# EAGLE design ottoesp-2s-wrover (EAGLE 9.6.2)
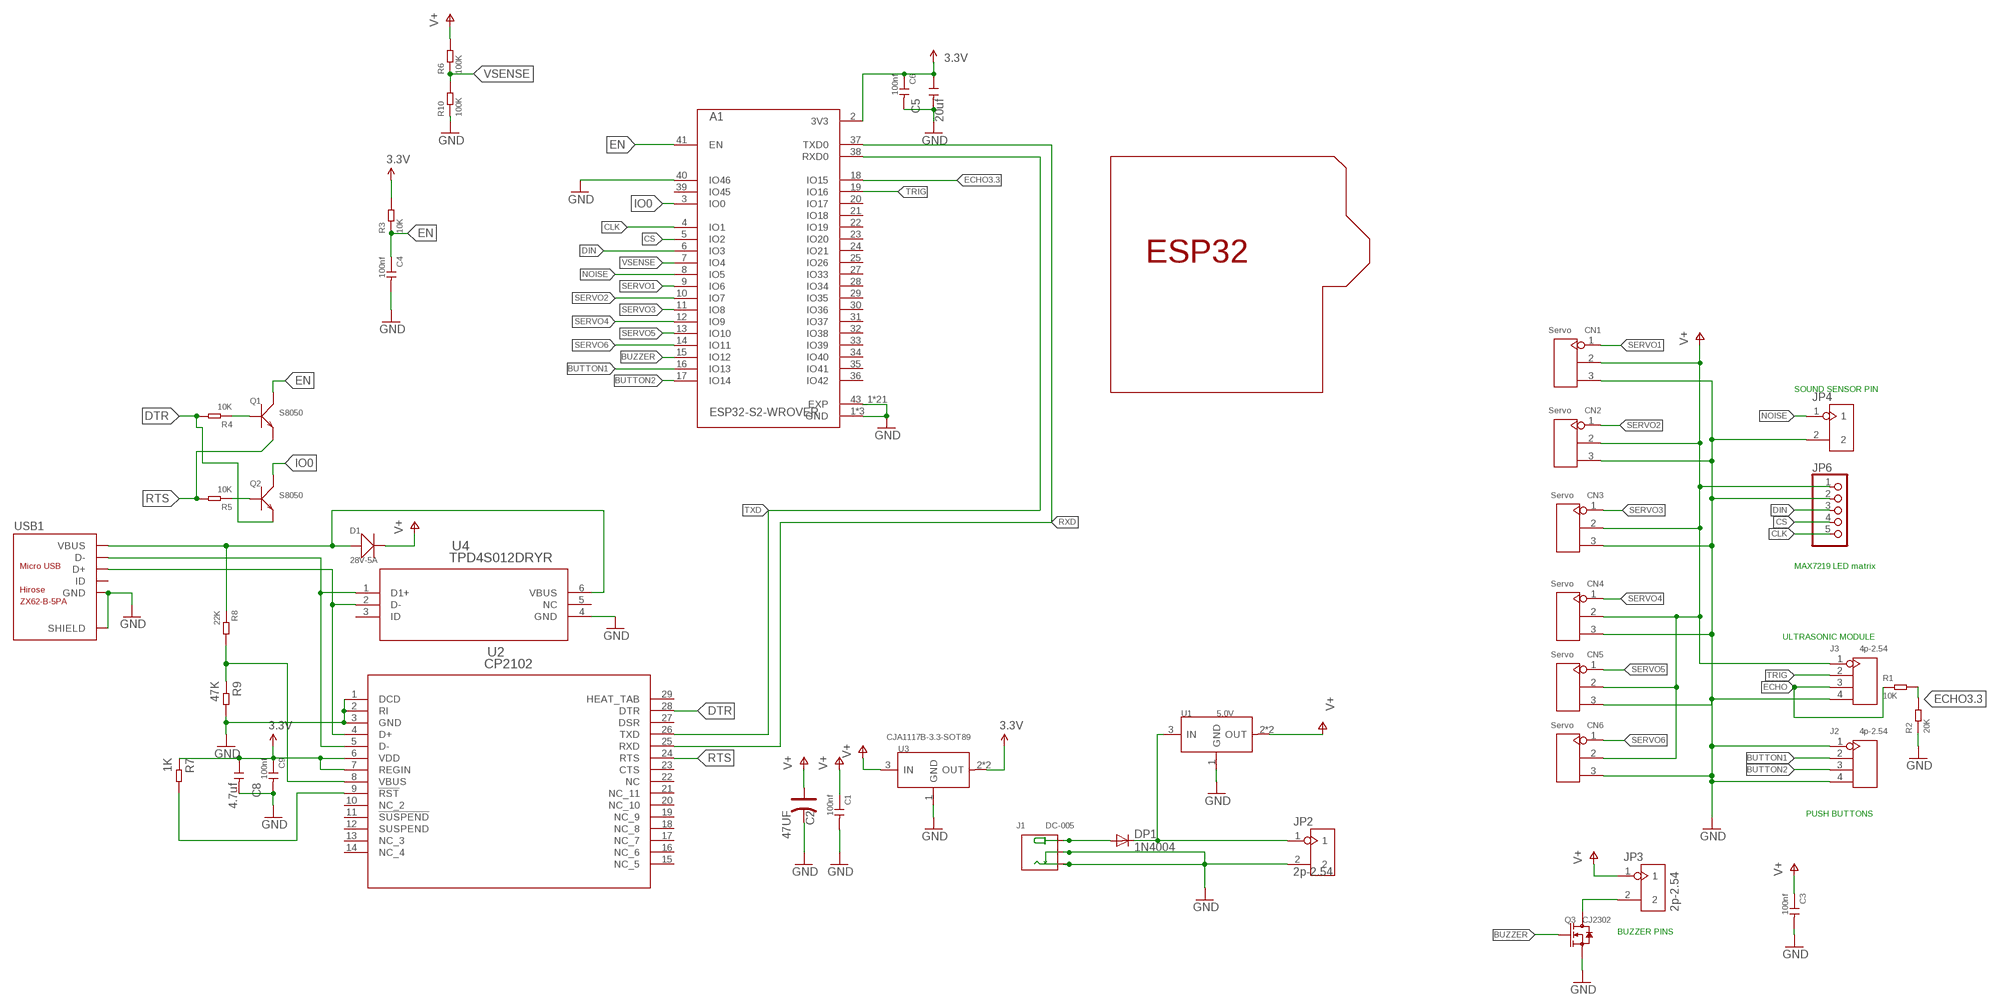
[diagram p0: schematic, sheet 1]

## Parts
A1  ESP32-S2-WROVER  [MODULE_ESP32-S2-WROVER]
C1  100nf  CERAMIC-100NF-50V-10%-X7R(0805)  [C0805]
C2  47UF  ALUMINUM-SMD-47UF-25V(D6.3-H5.3MM)  [ELECTRO-SMD-C-6MM]
C3  100nf  CERAMIC-100NF-50V-10%-X7R(0805)  [C0805]
C4  100nf  CERAMIC-100NF-50V-10%-X7R(0805)  [C0805]
C5  20uf  CERAMIC-22UF-16V-10%-X7R(1206)  [C1206]
C6  100nf  CERAMIC-100NF-50V-10%-X7R(0805)  [C0805]
C8  4.7uf  CERAMIC-4.7UF-25V-10%-X5R(0805)  [C0805]
C9  100nf  CERAMIC-100NF-50V-10%-X7R(0805)  [C0805]
CN1  Servo  DIP-BLACK-MALE-HEADER-VERT(3P-2.54)  [H3-2.54]
CN2  Servo  DIP-BLACK-MALE-HEADER-VERT(3P-2.54)  [H3-2.54]
CN3  Servo  DIP-BLACK-MALE-HEADER-VERT(3P-2.54)  [H3-2.54]
CN4  Servo  DIP-BLACK-MALE-HEADER-VERT(3P-2.54)  [H3-2.54]
CN5  Servo  DIP-BLACK-MALE-HEADER-VERT(3P-2.54)  [H3-2.54]
CN6  Servo  DIP-BLACK-MALE-HEADER-VERT(3P-2.54)  [H3-2.54]
D1  28V-5A  SMD-DIODE-SCHOTTKY-28V-5A(DO-214AA)  [DO-214AA]
DP1  1N4004  [DO41-10]
J1  DC-005  CONN-POWER-JACK-2.1MM(DC-005)  [DCJ3P-14.2X11.0X9.0MM]
J2  4p-2.54  DIP-BLACK-MALE-HEADER-VERT(4P-2.54)  [H4-2.54]
J3  4p-2.54  DIP-BLACK-MALE-HEADER-VERT(4P-2.54)  [H4-2.54]
JP2  2p-2.54  DIP-BLACK-MALE-HEADER-VERT(2P-2.54)  [H2-2.54]
JP3  2p-2.54  DIP-BLACK-MALE-HEADER-VERT(2P-2.54)  [H2-2.54]
JP4  2p-2.54  DIP-BLACK-MALE-HEADER-VERT(2P-2.54)  [H2-2.54]
JP6  PINHD-1X5  [1X05]
Q1  S8050  SMD-TRANSISTORS-NPN-25V-500MW-S8050(SOT-23)  [SOT-23]
Q2  S8050  SMD-TRANSISTORS-NPN-25V-500MW-S8050(SOT-23)  [SOT-23]
Q3  CJ2302  SMD-MOSFET-N-CH-20V-2.1A-CJ2302(SOT-23)  [SOT-23]
R1  10K  SMD-RES-10K-1%-1/8W(0805)  [R0805]
R2  20K  SMD-RES-20K-5%-1/8W(0805)  [R0805]
R3  10K  SMD-RES-10K-1%-1/8W(0805)  [R0805]
R4  10K  SMD-RES-10K-1%-1/8W(0805)  [R0805]
R5  10K  SMD-RES-10K-1%-1/8W(0805)  [R0805]
R6  100K  SMD-RES-100K-1%-1/8W(0805)  [R0805]
R7  1K  SMD-RES-2K-1%-1/8W(0805)  [R0805]
R8  22K  SMD-RES-22K-1%-1/8W(0805)  [R0805]
R9  47K  SMD-RES-47K-5%-1/10W(0603)  [R0603]
R10  100K  SMD-RES-100K-1%-1/8W(0805)  [R0805]
U1  5.0V  PMIC-CJT1117-5.0(SOT223)  [SOT-223]
U2  CP2102  [QFN28N5X5-0P5P]
U3  CJA1117B-3.3-SOT89  PMIC-CJA1117B-3.3(SOT-89)  [SOT-89]
U4  TPD4S012DRYR  [DRY6]
U$2  ESP32_SHIELDSMALL  [ESP32_ARDUINOSHIELDSMALL]
USB1  ZX62-B-5PA  MICRO-USB-SMD(ZX62-B-5PA)  [MICRO-USB5+6P-SMD-0.65-AB]

## Nets
3.3V: A1.2(3V3) C5.1 C6.1 C8.1 C9.1 R3.2 R7.1 U2.6(VDD) U2.7(REGIN) U3.2(OUT) U3.4(OUT)
BUTTON1: A1.16(IO13) J2.2
BUTTON2: A1.17(IO14) J2.3
BUZZER: A1.15(IO12) Q3.1(G)
CLK: A1.4(IO1) JP6.5
CS: A1.5(IO2) JP6.4
DIN: A1.6(IO3) JP6.3
DTR: Q2.2(E) R4.2 U2.28(DTR)
ECHO: J3.3 R1.1
ECHO3.3: A1.18(IO15) R1.2 R2.2
EN: A1.41(EN) C4.1 Q1.3(C) R3.1
GND: A1.1(GND) A1.26(GND) A1.40(IO46) A1.42(GND) A1.43_1(EXP) A1.43_2(EXP) A1.43_3(EXP) A1.43_4(EXP) A1.43_5(EXP) A1.43_6(EXP) A1.43_7(EXP) A1.43_8(EXP) A1.43_9(EXP) A1.43_10(EXP) A1.43_11(EXP) A1.43_12(EXP) A1.43_13(EXP) A1.43_14(EXP) A1.43_15(EXP) A1.43_16(EXP) A1.43_17(EXP) A1.43_18(EXP) A1.43_19(EXP) A1.43_20(EXP) A1.43_21(EXP) C1.2 C2.- C3.2 C4.2 C5.2 C6.2 C8.2 C9.2 CN1.3 CN2.3 CN3.3 CN4.3 CN5.3 CN6.3 J1.-1(-) J1.-2(CDN) J2.1 J2.4 J3.4 JP2.2 JP4.2 JP6.2 Q3.2(S) R2.1 R9.2 R10.1 U1.1(GND) U2.1(DCD) U2.2(RI) U2.3(GND) U3.1(GND) U4.4(GND) USB1.5(GND) USB1.P1(SHIELD) USB1.P2(SHIELD) USB1.P3(SHIELD) USB1.P4(SHIELD) USB1.P5(SHIELD) USB1.P6(SHIELD)
IO0: A1.3(IO0) Q2.3(C)
N$3: JP3.2 Q3.3(D)
N$4: Q1.1(B) R4.1
N$5: Q2.1(B) R5.1
N$6: R7.2 U2.9(!RST)
N$7: R8.2 R9.1 U2.8(VBUS)
N$8: U2.5(D-) U4.1(D1+) USB1.2(D-)
N$9: DP1.A J1.+
N$10: U2.4(D+) U4.2(D-) USB1.3(D+)
N$11: DP1.C JP2.1 U1.3(IN)
NOISE: A1.8(IO5) JP4.1
RTS: Q1.2(E) R5.2 U2.24(RTS)
RXD: A1.37(TXD0) U2.25(RXD)
SERVO1: A1.9(IO6) CN1.1
SERVO2: A1.10(IO7) CN2.1
SERVO3: A1.11(IO8) CN3.1
SERVO4: A1.12(IO9) CN4.1
SERVO5: A1.13(IO10) CN5.1
SERVO6: A1.14(IO11) CN6.1
TRIG: A1.19(IO16) J3.2
TXD: A1.38(RXD0) U2.26(TXD)
V+: C1.1 C2.+ C3.1 CN1.2 CN2.2 CN3.2 CN4.2 CN5.2 CN6.2 D1.- J3.1 JP3.1 JP6.1 R6.2 U1.2(OUT) U1.TER(OUT) U3.3(IN)
VBUS: D1.+ R8.1 U4.6(VBUS) USB1.1(VBUS)
VSENSE: A1.7(IO4) R6.1 R10.2
Unconnected: A1.20(IO17) A1.21(IO18) A1.22(IO19) A1.23(IO20) A1.24(IO21) A1.25(IO26) A1.27(IO33) A1.28(IO34) A1.29(IO35) A1.30(IO36) A1.31(IO37) A1.32(IO38) A1.33(IO39) A1.34(IO40) A1.35(IO41) A1.36(IO42) A1.39(IO45) U2.10(NC_2) U2.11(!SUSPEND) U2.12(SUSPEND) U2.13(NC_3) U2.14(NC_4) U2.15(NC_5) U2.16(NC_6) U2.17(NC_7) U2.18(NC_8) U2.19(NC_9) U2.20(NC_10) U2.21(NC_11) U2.22(NC) U2.23(CTS) U2.27(DSR) U2.29(HEAT_TAB) U4.3(ID) U4.5(NC) USB1.4(ID)

## Notes on the sheet
- SOUND SENSOR PIN
- MAX7219 LED matrix
- ULTRASONIC MODULE
- PUSH BUTTONS
- BUZZER PINS

## Library data of the parts
A1 = ESP32-S2-WROVER:ESP32-S2-WROVER: WiFi 802.11b/g/n Transceiver Module 2.4GHz Antenna Not Included Surface Mount Check prices <https://snapeda.com/parts/ESP32-S2-WROVER/Espressif%20Systems/view-part/?ref=eda>; AVAILABILITY: Warning; DESCRIPTION: WiFi 802.11b/g/n Transceiver Module 2.4GHz Antenna Not Included Surface Mount; DIGIKEY-PURCHASE-URL: https://snapeda.com/shop?store=DigiKey&id=4614060; MF: Espressif Systems; MP: ESP32-S2-WROVER; PACKAGE: VFQFN-56 Espressif Systems; PRICE: None
C1 C4 C6 C9 = OPL_Capacitor:CERAMIC-100NF-50V-10%-X7R(0805): 302010165; MPN: CC0805KRX7R9BB104
C2 = OPL_Capacitor:ALUMINUM-SMD-47UF-25V(D6.3-H5.3MM): 302030059; MPN: CS1E470M-CRE54
C3 = Seeed-Capacitor:CERAMIC-100NF-50V-10%-X7R(0805): 302010165; MPN: CC0805KRX7R9BB104
C5 = OPL_Capacitor:CERAMIC-22UF-16V-10%-X7R(1206): 302010182
C8 = OPL_Capacitor:CERAMIC-4.7UF-25V-10%-X5R(0805): 302010146; MPN: CC0805KKX5R8BB475
CN1-CN6 = OPL_Connector:DIP-BLACK-MALE-HEADER-VERT(3P-2.54): 320020079; VALUE: 3p-2.54
D1 = Seeed-Diode:SMD-DIODE-SCHOTTKY-28V-5A(DO-214AA): 304020021; MPN: SS54B
DP1 = adafruit:1N4004: DIODE General purpose 1N400x type rectifier (With bigger pads) http://www.ladyada.net/library/pcb/eaglelibrary.html
J1 = OPL_Connector:CONN-POWER-JACK-2.1MM(DC-005): 320120003; MPN: DC-005
J2 J3 = OPL_Connector:DIP-BLACK-MALE-HEADER-VERT(4P-2.54): 320020017; MPN: P125-1104A0BS116A1
JP2-JP4 = OPL_Connector:DIP-BLACK-MALE-HEADER-VERT(2P-2.54): 320020016; MPN: P125-1102A0BS116A1
JP6 = pinhead:PINHD-1X5: PIN HEADER
Q1 Q2 = OPL_Discrete_Semiconductor:SMD-TRANSISTORS-NPN-25V-500MW-S8050(SOT-23): 305010017; MPN: S8050
Q3 = Seeed-Transistor:SMD-MOSFET-N-CH-20V-2.1A-CJ2302(SOT-23): 305030015; MPN: CJ2302
R1 R3-R5 = OPL_Resistor:SMD-RES-10K-1%-1/8W(0805): 301012152; MPN: RC0805FR-0710KL
R2 = OPL_Resistor:SMD-RES-20K-5%-1/8W(0805): 301012190; MPN: RC0805JR-071KL; VALUE: 1K
R6 R10 = OPL_Resistor:SMD-RES-100K-1%-1/8W(0805): 301012150; MPN: RC0805JR-071KL; VALUE: 1K
R7 = OPL_Resistor:SMD-RES-2K-1%-1/8W(0805): 301012164; MPN: RC0805JR-071KL
R8 = OPL_Resistor:SMD-RES-22K-1%-1/8W(0805): 301012161; MPN: RC0805JR-071KL; VALUE: 1K
R9 = OPL_Resistor:SMD-RES-47K-5%-1/10W(0603): 301010084; MPN: RC0603JR-0747KL
U1 = Seeed-IC:PMIC-CJT1117-5.0(SOT223): 310030096; MPN: CJT1117-5.0; VALUE: CJT1117-5.0-SOT223
U2 = cp2102:CP2102; MANUFACTURER_PART_NUMBER: CP2102; VENDOR: Silicon Labs
U3 = OPL_IC:PMIC-CJA1117B-3.3(SOT-89): 310030095; MPN: CJA1117B-3.3
U4 = TPD4S012:TPD4S012DRYR; MANUFACTURER_PART_NUMBER: TPD4S012DRYR; VENDOR: Texas Instruments
U$2 = ottoesp:ESP32_SHIELDSMALL
USB1 = OPL_Connector:MICRO-USB-SMD(ZX62-B-5PA): 320010005; MPN: ZX62-B-5PA

## Board
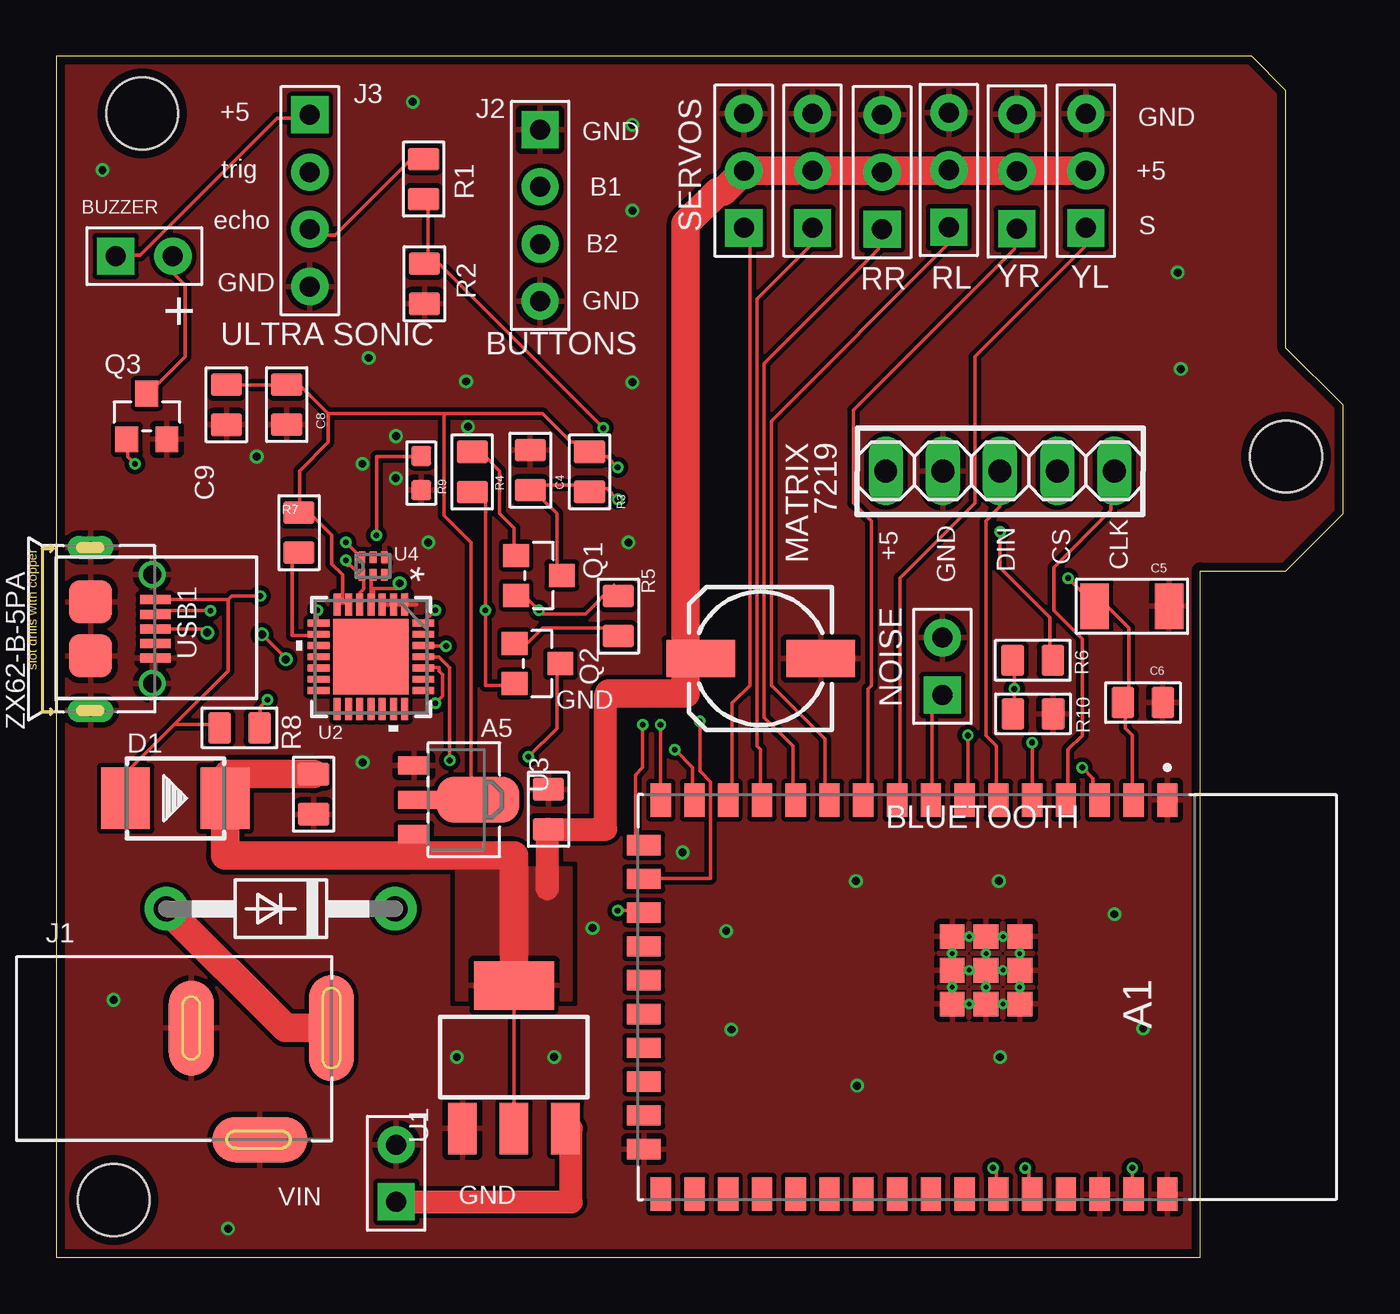
[diagram p1: board, top side]
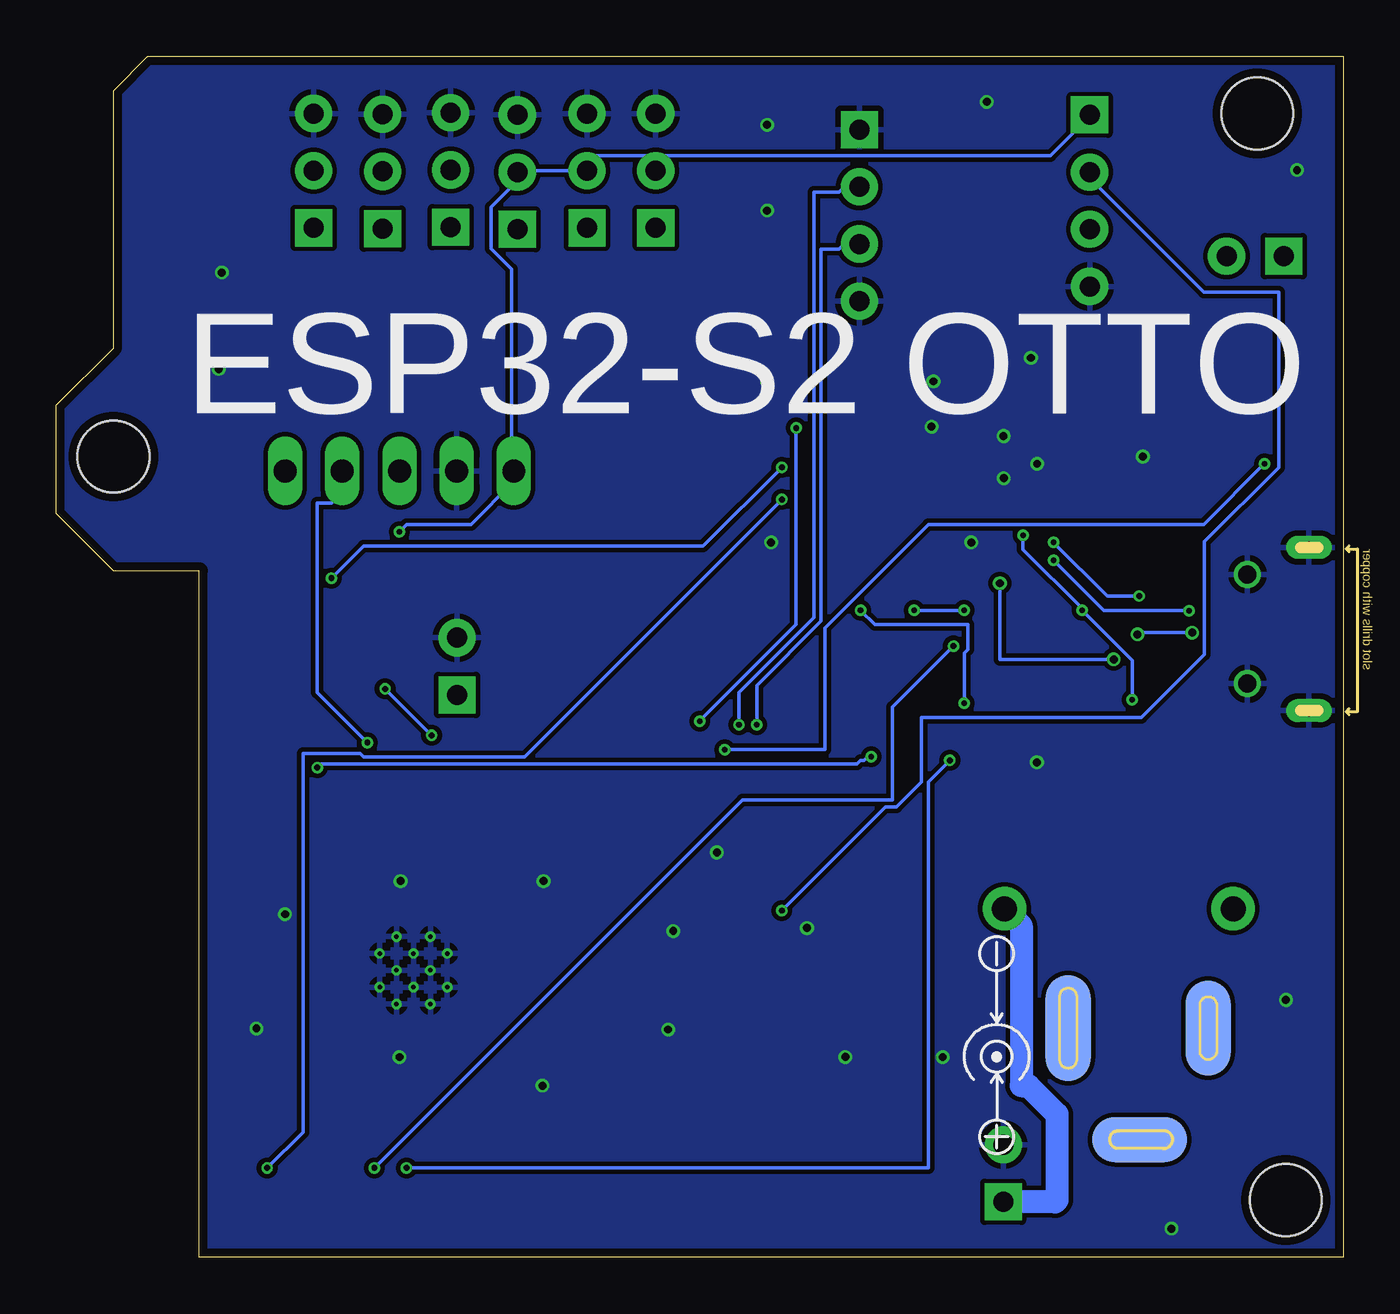
[diagram p2: board, bottom side, seen from below]

Size 57.15 x 53.34 mm. Coordinates in mm from the lower left corner, seen from the top.
Copper layers (1*16): Top 0.035559375mm / dielectric 1.6mm / Bottom 0.035559375mm
Design rules "oshpark-2layer": minimum track width 6mil, minimum drill 10mil, track to track 6mil, track to pad 6mil, pad to pad 6mil, via to via 6mil, smd to smd 6mil, copper to edge 15mil, drill to drill 6mil, minimum pad ring 5mil, minimum via ring 5mil, stop-mask expansion 2.5mil, vias tented up to drill 0mil, thermal gap 10mil

### Footprints (pad centres in the part's own frame; a part is rotated, then mirrored left to right if it is on the bottom)
MODULE_ESP32-S2-WROVER = smd 1.5 x 0.9: 1 -8.75,8; 2 -8.75,6.5; 3 -8.75,5; 4 -8.75,3.5; 5 -8.75,2; 6 -8.75,0.5; 7 -8.75,-1; 8 -8.75,-2.5; 9 -8.75,-4; 10 -8.75,-5.5; 11 -8.75,-7; 12 -8.75,-8.5; 13 -8.75,-10; 14 -8.75,-11.5; 15 -8.75,-13; 16 -8.75,-14.5; 27 8.75,-14.5; 28 8.75,-13; 29 8.75,-11.5; 30 8.75,-10; 31 8.75,-8.5; 32 8.75,-7; 33 8.75,-5.5; 34 8.75,-4; 35 8.75,-2.5; 36 8.75,-1; 37 8.75,0.5; 38 8.75,2; 39 8.75,3.5; 40 8.75,5; 41 8.75,6.5; 42 8.75,8 | smd 0.9 x 1.5: 17 -6.75,-15.25; 18 -5.25,-15.25; 19 -3.75,-15.25; 20 -2.25,-15.25; 21 -0.75,-15.25; 22 0.75,-15.25; 23 2.25,-15.25; 24 3.75,-15.25; 25 5.25,-15.25; 26 6.75,-15.25 | smd 1.1 x 1.1: 43_1 -2.69,1.45; 43_2 -1.19,1.45; 43_3 0.31,1.45; 43_4 -2.69,-0.05; 43_5 -1.19,-0.05; 43_6 0.31,-0.05; 43_7 -2.69,-1.55; 43_8 -1.19,-1.55; 43_9 0.31,-1.55 | drill 0.2 pad 0.3: 43_10 -1.94,1.45; 43_11 -0.44,1.45; 43_12 -2.69,0.7; 43_13 -1.19,0.7; 43_14 0.31,0.7; 43_15 -1.94,-0.05; 43_16 -0.44,-0.05; 43_17 -2.69,-0.8; 43_18 -1.19,-0.8; 43_19 0.31,-0.8; 43_20 -1.94,-1.55; 43_21 -0.44,-1.55
C0805 = smd 1.397 x 1.016: 1 0,0.889; 2 0,-0.889
ELECTRO-SMD-C-6MM = smd 3.048 x 1.651: + 2.667,0; - -2.667,0
C1206 = smd 1.27 x 2.032: 1 -1.651,0; 2 1.651,0
H3-2.54 = drill 0.889 pad 1.651 square: 1 0,2.54 | drill 0.889 pad 1.651: 2 0,0; 3 0,-2.54
DO-214AA = smd 2.159 x 2.743: + -2.21,0; - 2.21,0
DO41-10 = drill 1.118 pad 1.93: A 5.08,0; C -5.08,0
DCJ3P-14.2X11.0X9.0MM = smd 2 x 4.7: + 3.175,0 | smd 2 x 4.7 bottom: +1 3.175,0 | smd 2 x 4.2: -1 -3.048,0 | smd 4.2 x 2: -2 0,-4.953 | smd 2 x 4.2 bottom: -3 -3.048,0 | smd 4.2 x 2 bottom: -4 0,-4.953
H4-2.54 = drill 0.889 pad 1.651 square: 1 0,3.81 | drill 0.889 pad 1.651: 2 0,1.27; 3 0,-1.27; 4 0,-3.81
H2-2.54 = drill 0.889 pad 1.651 square: 1 0,1.27 | drill 0.889 pad 1.651: 2 0,-1.27
1X05 = drill 1.016 long: 1 -5.08,0; 2 -2.54,0; 3 0,0; 4 2.54,0; 5 5.08,0
SOT-23 = smd 1.016 x 1.143: 1 -0.889,-1.016; 2 0.889,-1.016; 3 0,1.016
R0805 = smd 1.397 x 1.016: 1 0,0.889; 2 0,-0.889
R0603 = smd 0.889 x 0.889: 1 0,0.762; 2 0,-0.762
SOT-223 = smd 1.27 x 2.286: 1 -2.286,-3.175; 2 0,-3.175; 3 2.286,-3.175 | smd 3.556 x 2.159: TER 0,3.175
QFN28N5X5-0P5P = smd 0.965 x 0.305: 1 -2.324,1.5; 2 -2.324,1; 3 -2.324,0.5; 4 -2.324,0; 5 -2.324,-0.5; 6 -2.324,-1; 7 -2.324,-1.5; 15 2.324,-1.5; 16 2.324,-1; 17 2.324,-0.5; 18 2.324,0; 19 2.324,0.5; 20 2.324,1; 21 2.324,1.5 | smd 0.305 x 0.965: 8 -1.5,-2.324; 9 -1,-2.324; 10 -0.5,-2.324; 11 0,-2.324; 12 0.5,-2.324; 13 1,-2.324; 14 1.5,-2.324; 22 1.5,2.324; 23 1,2.324; 24 0.5,2.324; 25 0,2.324; 26 -0.5,2.324; 27 -1,2.324; 28 -1.5,2.324 | smd 3.353 x 3.353: 29 0,0
SOT-89 = smd 0.8 x 1.4: 1 -1.524,-1.905; 3 1.524,-1.905 | smd 0.8 x 1.9: 2 0,-1.651 | smd 2.032 x 3.65: 4 0,0.94
DRY6 = smd 0.52 x 0.3: 1 -0.385,0.5; 2 -0.385,0; 3 -0.385,-0.5; 4 0.385,-0.5; 5 0.385,0; 6 0.385,0.5
ESP32_ARDUINOSHIELDSMALL = hole 3.2: -13.97,33.02; 36.83,17.78; -15.24,-15.24
MICRO-USB5+6P-SMD-0.65-AB = smd 0.4 x 1.35: 1 -1.3,2.875; 2 -0.65,2.875; 3 0,2.875; 4 0.65,2.875; 5 1.3,2.875 | smd 1.9 x 1.9: P1 -1.2,0; P2 1.2,0 | drill 0.508 pad 1.016 long: P3 -3.625,0; P4 3.625,0 | drill 0.8: P5 -2.425,2.73; P6 2.425,2.73

### Placement (x,y rotation side)
A1  41.34,11.55 270 top
C1  21.85,19.9 180 top
C2  31.28,26.6 180 top
C3  11.42,20.57 0 top
C4  21.04,34.96 180 top
C5  47.76,28.91 0 top
C6  48.26,24.64 90 top
C8  10.23,37.87 0 top
C9  7.55,37.86 0 top
CN1  45.72,48.26 180 top
CN2  42.66,48.23 180 top
CN3  39.63,48.29 180 top
CN4  36.67,48.19 180 top
CN5  33.58,48.26 180 top
CN6  30.53,48.26 180 top
D1  5.28,20.38 0 top
DP1  9.96,15.48 180 top
J1  9.03,10.18 0 top
J2  21.49,46.27 0 top
J3  11.25,46.93 0 top
JP2  15.09,3.73 180 top
JP3  3.9,44.46 90 top
JP4  39.35,26.25 180 top
JP6  41.91,34.92 0 top
Q1  21.43,30.28 270 top
Q2  21.37,26.36 270 top
Q3  4.02,37.35 0 top
R1  16.31,47.89 0 top
R2  16.34,43.23 180 top
R3  23.68,34.88 180 top
R4  18.47,34.88 0 top
R5  24.96,28.47 180 top
R6  43.36,26.51 90 top
R7  10.77,32.18 0 top
R8  8.13,23.51 90 top
R9  16.2,34.83 0 top
R10  43.37,24.13 270 top
U1  20.32,8.89 0 top
U2  13.97,26.67 270 top
U3  17.78,20.32 270 top
U4  14.06,30.7 90 top
U$2  17.78,17.78 0 top
USB1  1.52,27.91 270 top

### Tracks (layer width: path | path; a pad name or v marks a point on that pad's centre or on a via)
3.3V  (via drill 0.25)
  Top 0.152: 18.41,20.32 U3.2 | 10.79,33.5 10.79,34.92 12.07,36.2 12.07,37.47 | 10.79,33.5 10.79,33.02 R7.1 10.79,33.5 | 12.07,37.47 10.79,38.73 C8.1 10.16,38.73 7.62,38.73 C9.1 | 12.07,37.47 17.23,37.47 | 17.23,37.47 21.59,37.47 22.86,36.2 23.5,36.2 R3.2 24.13,35.56 24.45,35.56 v24.92,35.08 | 18.41,20.32 18.41,31.75 17.23,32.94 17.23,37.47 | 18.41,20.32 U3.4 | A1.2 47.78,20.32 47.78,23.18 47.47,23.5 47.47,24.61 C6.1 47.62,24.77 47.62,27.94 46.36,29.21 C5.1 46.04,29.05 v44.93,30.16 | 12.7,29.05 12.86,29.05 U2.6 | 12.7,29.05 12.54,29.05 U2.7 | 12.7,29.05 12.7,30.32 12.22,30.8 12.22,32.07 10.79,33.5
  Bottom 0.152: v44.93,30.16 43.5,31.59 28.42,31.59 v24.92,35.08
BUTTON1  (via drill 0.25)
  Top 0.152: v26.83,23.65 26.83,20.32 A1.16
  Bottom 0.152: v26.83,23.65 26.83,25.08 23.5,28.42 23.5,47.31 22.38,47.31 22.22,47.47 21.59,47.47 J2.2
BUTTON2  (via drill 0.25)
  Top 0.152: v26.04,23.65 26.04,21.75 25.72,21.43 25.72,18.73 26.04,18.41 A1.17
  Bottom 0.152: v26.04,23.65 26.04,25.4 23.18,28.26 23.18,44.77 22.38,44.77 22.22,44.93 21.59,44.93 J2.3
BUZZER  (via drill 0.25)
  Top 0.152: Q3.1 3.18,36.2 3.18,35.56 v3.49,35.24 | v27.46,22.54 28.26,21.75 28.26,20.32 A1.15
  Bottom 0.152: v3.49,35.24 6.19,32.54 18.41,32.54 23.02,27.94 23.02,22.54 v27.46,22.54
CLK
  Top 0.152: JP6.5 46.83,34.77 46.83,33.18 44.29,30.64 44.29,28.73 45.56,27.46 45.56,23.18 44.93,22.54 44.93,20.32 A1.4
CS  (via drill 0.25)
  Top 0.152: v43.34,22.86 43.34,20.32 A1.5
  Bottom 0.152: v43.34,22.86 45.56,25.08 45.56,33.5 44.93,33.5 44.77,33.66 44.45,33.66 JP6.4
DIN
  Top 0.152: A1.6 41.75,20.32 41.75,22.7 41.28,23.18 41.28,32.7 41.91,33.34 JP6.3
DTR  (via drill 0.25)
  Top 0.152: Q2.2 20.32,25.4 19.05,25.4 v19.05,28.73 19.05,33.66 R4.2 | v16.83,28.73 16.35,28.26 U2.28
  Bottom 0.152: v19.05,28.73 v16.83,28.73
ECHO
  Top 0.152: R1.1 15.88,48.9 12.38,45.4 11.27,45.4 11.27,45.56 J3.3
ECHO3.3  (via drill 0.25)
  Top 0.152: 16.51,44.61 16.51,44.45 R2.2 16.51,44.61 | 16.51,44.61 16.51,46.99 R1.2 | v28.57,23.81 28.57,21.59 29.05,21.11 29.05,16.83 26.19,16.83 A1.18 | 16.51,44.61 v24.29,36.83
  Bottom 0.152: v28.57,23.81 24.29,28.1 v24.29,36.83
EN  (via drill 0.25)
  Top 0.152: Q1.3 22.22,30.48 22.22,33.02 21.59,33.66 C4.1 21.59,34.29 23.5,34.29 R3.1 23.81,34.13 24.45,34.13 v24.92,33.66 | v47.78,3.97 47.78,2.86 A1.41
  Bottom 0.152: v47.78,3.97 46.2,5.56 46.2,22.38 43.66,22.38 43.5,22.23 36.35,22.23 v24.92,33.66
GND  (via drill 0.35)
  Top 0.152: R9.2 16.2,34.14 16.27,34.14 | 39.83,12.65 A1.43_8 | U2.3 U2.1 16,28.99
  other vias: 2.54,11.43 8.89,35.56 13.58,35.24 15.07,34.6 18.28,36.89 15.08,36.47 16.51,31.75 13.86,39.94 18.19,38.9 25.58,38.87 25.4,31.75 17.78,8.89 7.62,1.27 35.56,7.62 29.97,10.11 35.51,16.71 46.99,15.24 49.94,39.45 49.8,43.73 15.83,51.32 2.04,48.29 25.58,46.49 25.58,50.3 27.81,17.98 23.81,14.62 13.6,21.98 48.26,10.16 41.91,8.89 41.86,16.71 29.75,14.49 22.11,8.9
  pour Bottom (isolate 0.203): 0,53.34 53.34,53.34 54.61,52.07 54.61,40.64 57.15,38.1 57.15,33.02 54.61,30.48 50.8,30.48 50.8,0 0,0
  pour Top (isolate 0.203, rank 2): 0,53.34 53.34,53.34 54.61,52.07 54.61,40.64 57.15,38.1 57.15,33.02 54.61,30.48 50.8,30.48 50.8,0 0,0
IO0  (via drill 0.25)
  Top 0.152: v20.95,22.23 22.22,23.5 22.22,26.04 Q2.3 | v45.56,21.75 46.04,21.27 46.04,20.48 46.2,20.32 A1.3
  Bottom 0.152: v45.56,21.75 45.4,21.91 21.59,21.91 21.43,22.07 21.27,22.07 21.11,22.23 v20.95,22.23
N$3
  Top 0.152: Q3.3 4.45,38.73 5.71,40.01 5.71,43.18 5.08,43.81 5.08,44.45 JP3.2
N$4
  Top 0.152: Q1.1 20.32,31.11 20.32,32.38 19.68,33.02 19.68,34.92 19.05,35.56 R4.1
N$5
  Top 0.152: Q2.1 20.32,27.3 20.95,27.3 21.59,27.94 24.76,27.94 R5.1
N$6
  Top 0.152: U2.9 11.59,27.62 10.48,27.62 10.48,31.11 10.64,31.27 R7.2
N$7  (via drill 0.25)
  Top 0.152: R9.1 15.88,35.56 14.21,35.56 v14.21,32.06 | v11.59,28.73 11.59,28.26 U2.8 | v9.37,24.77 9.05,24.45 9.05,23.65 R8.2
  Bottom 0.152: v9.37,24.77 9.37,26.51 v11.59,28.73 11.59,28.81 14.21,31.43 v14.21,32.06
N$8  (via drill 0.25)
  Top 0.152: 13.65,30.13 13.65,29.69 13.49,29.53 13.49,29.05 U2.5 | 13.65,30.13 13.65,30.29 U4.1 | v12.86,30.96 12.86,30.8 12.94,30.72 13.06,30.72 13.65,30.13 | v6.83,28.71 5.4,28.73 4.45,28.73 4.45,28.57 USB1.2
  Bottom 0.152: v12.86,30.96 | v12.86,30.96 10.63,28.72 10.63,28.71 v6.83,28.71
N$9
  Top 1.27: DP1.A 10.18,10.18 J1.+
N$10  (via drill 0.35)
  Top 0.152: U4.2 13.97,30.22 13.97,29.21 | U2.4 13.97,29.21 | USB1.3 6.65,27.91 6.7,27.86 v6.7,27.74 | v9.13,27.66 10.22,26.57 | 10.22,26.57 | 10.22,26.57 10.2,26.55 v10.19,26.55 | v15.24,29.93 15.24,29.7 14.09,29.7 14.09,29.21 13.97,29.21
  Bottom 0.152: v6.7,27.74 9.05,27.74 v9.13,27.66 | v10.19,26.55 15.24,26.55 v15.24,29.93
N$11
  Top 1.016: JP2.1 22.86,2.46 22.86,5.71 U1.3
  Bottom 1.016: DP1.C 14.29,14.72 14.29,7.62 13.97,7.62 12.7,6.35 12.7,2.54 12.78,2.46 JP2.1
NOISE
  Top 0.152: A1.8 38.89,20.32 38.89,24.61 39.35,24.61 JP4.1
RTS  (via drill 0.25)
  Top 0.152: Q1.2 20.95,29.21 v21.43,28.73 21.59,28.57 23.5,28.57 24.76,29.84 R5.2 | v16.83,24.61 17.14,24.92 17.14,25.88 16.99,26.04 16.99,26.19 16.35,26.19 U2.24
  Bottom 0.152: v16.83,24.61 16.83,26.83 16.67,26.99 16.67,28.1 20.8,28.1 v21.43,28.73
RXD  (via drill 0.25)
  Top 0.152: U2.25 16.99,26.67 17.46,26.19 v17.46,22.07 | v41.59,3.97 41.75,3.81 41.75,2.86 A1.37
  Bottom 0.152: v17.46,22.07 18.41,21.11 18.41,3.97 v41.59,3.97
SERVO1
  Top 0.152: CN1.1 45.72,44.93 40.8,40.01 40.8,33.5 37.47,30.16 37.47,20.32 A1.9
SERVO2
  Top 0.152: A1.10 35.88,20.32 36.04,20.48 36.04,25.24 36.19,25.4 36.19,32.7 35.4,33.5 35.4,37.62 42.55,44.77 42.55,45.56 CN2.1
SERVO3
  Top 0.152: A1.11 34.29,20.32 34.13,20.48 34.13,23.02 31.75,25.4 31.75,37.15 39.53,44.93 39.53,45.72 CN3.1
SERVO4
  Top 0.152: A1.12 32.7,20.32 32.7,22.7 31.43,23.97 31.43,39.69 36.51,44.77 36.51,45.56 CN4.1
SERVO5
  Top 0.152: A1.13 31.27,20.32 31.27,22.54 31.11,22.7 31.11,42.55 33.5,44.93 33.5,45.72 CN5.1
SERVO6
  Top 0.152: A1.14 29.85,20.32 30,20.48 30,24.61 30.8,25.4 30.8,45.72 CN6.1
TRIG  (via drill 0.25)
  Top 0.152: v24.92,15.4 26.04,15.4 A1.19
  Bottom 0.152: v24.92,15.4 20.32,20 19.84,20 18.73,21.11 18.73,23.97 8.96,23.97 6.17,26.77 6.17,31.78 6.16,31.78 2.86,35.08 2.86,42.86 6.19,42.86 11.27,47.94 J3.2
TXD  (via drill 0.25)
  Top 0.152: v17.3,27.15 16.35,27.15 U2.26 | v43.02,3.97 43.18,3.81 43.18,2.86 A1.38
  Bottom 0.152: v17.3,27.15 20,24.45 20,20.32 26.67,20.32 v43.02,3.97
V+  (via drill 0.25)
  Top 0.152: 7.62,20.95 D1.- | 36.83,48.26 CN4.2 | 27.94,26.67 28.57,26.67 C2.+ | 40,48.26 CN3.2 | 42.55,48.26 CN2.2 | v41.91,32.23 41.91,30.64 44.13,28.42 44.13,26.67 R6.2 | U3.3 15.88,18.14 | U1.TER U1.2 | JP3.1 2.64,44.5 3.71,44.5 9.8,50.6 11.18,50.6 J3.1
  Top 1.016: 24.55,25.04 24.39,25.04 24.39,19.01 C1.1 21.79,19.01 21.79,16.37 21.8,16.37
  Top 1.27: CN1.2 42.55,48.26 40,48.26 36.83,48.26 CN5.2 CN6.2 29.6,47.33 29.37,47.33 27.94,45.9 27.94,26.67 27.94,25.04 24.55,25.04 | D1.- 7.49,17.84 15.57,17.84 | 15.57,17.84 15.88,18.14 | C3.1 7.62,21.45 7.62,20.95 | U1.TER 20.32,17.84 15.57,17.84
  Bottom 0.152: v41.91,32.23 41.59,32.54 38.73,32.54 36.83,34.45 JP6.1 36.93,35.05 36.93,43.89 37.85,44.81 37.85,46.63 36.68,47.8 CN4.2 36.6,48.26 33.72,48.26 CN5.2 33.58,48.92 13,48.92 11.33,50.6 J3.1
  pour Top (isolate 0.051): 17.78,11.43 17.78,17.28 22.86,17.28 22.86,11.43
VBUS  (via drill 0.25)
  Top 0.152: 7.62,29.21 4.45,29.21 USB1.1 | 7.62,29.21 7.62,26.04 5.24,23.65 | 5.24,23.65 3.18,21.59 3.18,20.95 D1.+ | v12.86,31.75 13.49,31.11 U4.6 | v9.05,29.37 7.78,29.37 7.62,29.21 | 5.24,23.65 7.14,23.65 R8.1
  Bottom 0.152: v12.86,31.75 10.48,29.37 v9.05,29.37
VSENSE  (via drill 0.25)
  Top 0.152: R6.1 42.55,26.51 v42.55,25.24 42.55,24.13 R10.2 | v40.48,23.18 40.48,20.32 A1.7
  Bottom 0.152: v42.55,25.24 v40.48,23.18

### Text on the board
tNames: +5 | GND | GND | trig | +5 | B1 | BUZZER | echo | SERVOS | B2 | S | GND | RR | RL | YR | YL | GND | + | ULTRA | SONIC | BUTTONS | MATRIX | 7219 | GND | CLK | +5 | DIN | CS | GND | NOISE | A5 | BLUETOOTH | VIN | GND
bNames: ESP32-S2 OTTO